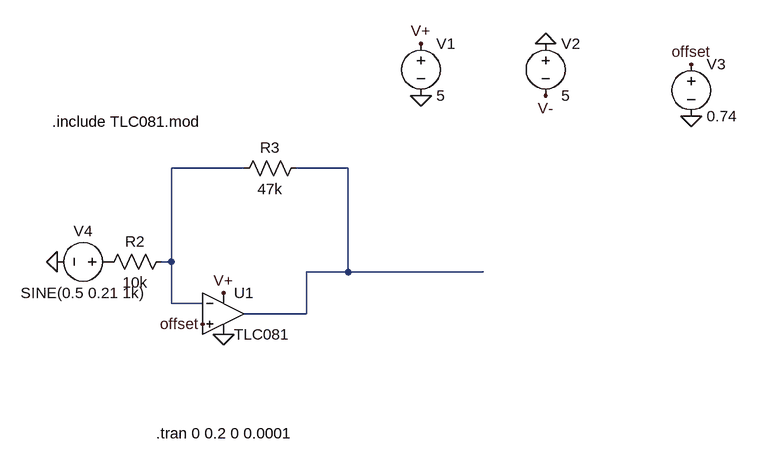
[diagram p0: schematic final_amp_block.asc]
final_amp_block.asc, the LTspice schematic file:
Version 4
SHEET 1 1876 1604
WIRE 656 64 544 64
WIRE 816 64 736 64
WIRE 544 208 544 64
WIRE 544 208 528 208
WIRE 816 224 816 64
WIRE 816 224 752 224
WIRE 1024 224 816 224
WIRE 544 272 544 208
WIRE 592 272 544 272
WIRE 752 288 752 224
WIRE 752 288 656 288
FLAG 1120 -128 0
FLAG 928 -48 0
FLAG 1120 -48 V-
FLAG 928 -128 V+
FLAG 624 256 V+
FLAG 1344 -16 0
FLAG 1344 -96 offset
FLAG 592 304 offset
FLAG 624 320 0
FLAG 368 208 0
SYMBOL res 544 192 R90
WINDOW 0 0 56 VBottom 2
WINDOW 3 32 56 VTop 2
SYMATTR InstName R2
SYMATTR Value 10k
SYMBOL res 752 48 R90
WINDOW 0 0 56 VBottom 2
WINDOW 3 32 56 VTop 2
SYMATTR InstName R3
SYMATTR Value 47k
SYMBOL voltage 928 -144 R0
WINDOW 123 0 0 Left 0
WINDOW 39 0 0 Left 0
SYMATTR InstName V1
SYMATTR Value 5
SYMBOL voltage 1120 -144 R0
WINDOW 123 0 0 Left 0
WINDOW 39 0 0 Left 0
SYMATTR InstName V2
SYMATTR Value 5
SYMBOL OpAmps\\opamp2 624 224 R0
SYMATTR InstName U1
SYMATTR Value TLC081
SYMBOL voltage 1344 -112 R0
WINDOW 123 0 0 Left 0
WINDOW 39 0 0 Left 0
SYMATTR InstName V3
SYMATTR Value 0.74
SYMBOL voltage 464 208 R90
WINDOW 0 -32 56 VBottom 2
WINDOW 3 32 56 VTop 2
WINDOW 123 0 0 Left 0
WINDOW 39 0 0 Left 0
SYMATTR InstName V4
SYMATTR Value SINE(0.5 0.21 1k)
TEXT 520 472 Left 2 !.tran 0 0.2 0 0.0001
TEXT 360 -8 Left 2 !.include TLC081.mod

The netlist it stands for:
* final_amp_block.asc
R2 N001 P001 10k
R3 N002 N001 47k
V1 V+ 0 5
V2 0 V- 5
XU1 offset N001 V+ 0 N002 TLC081  ; pins In+ In- V+ V- OUT
V3 offset 0 0.74
V4 P001 0 SINE(0.5 0.21 1k)
.tran 0 0.2 0 0.0001
.include TLC081.mod
.backanno
.end